# Altium schematic sheet 0053_DISPLAY - DDIA POR.SchDoc
size 848 x 558 mm
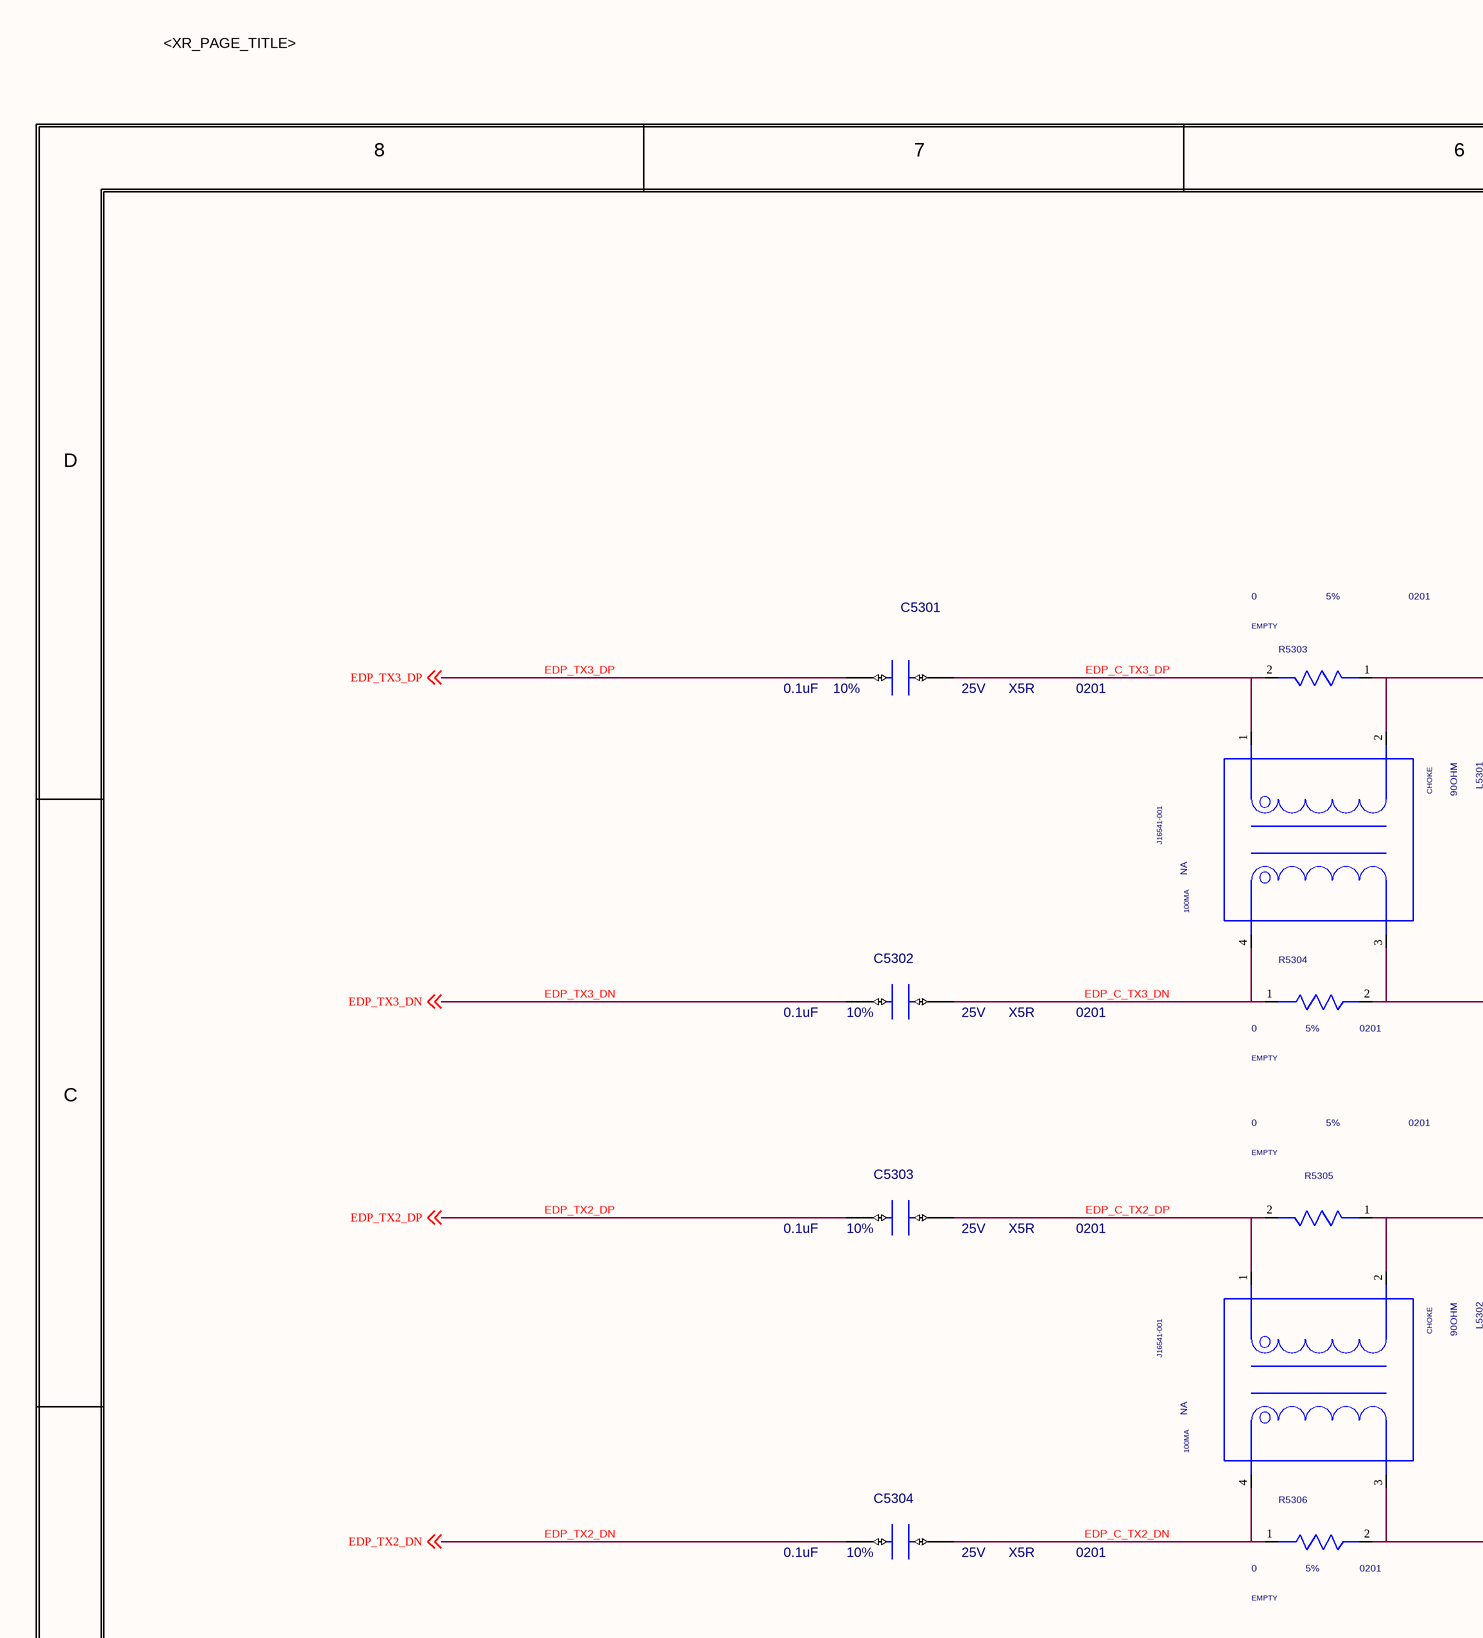
[diagram p0: 0053_DISPLAY - DDIA POR.SchDoc, top left]
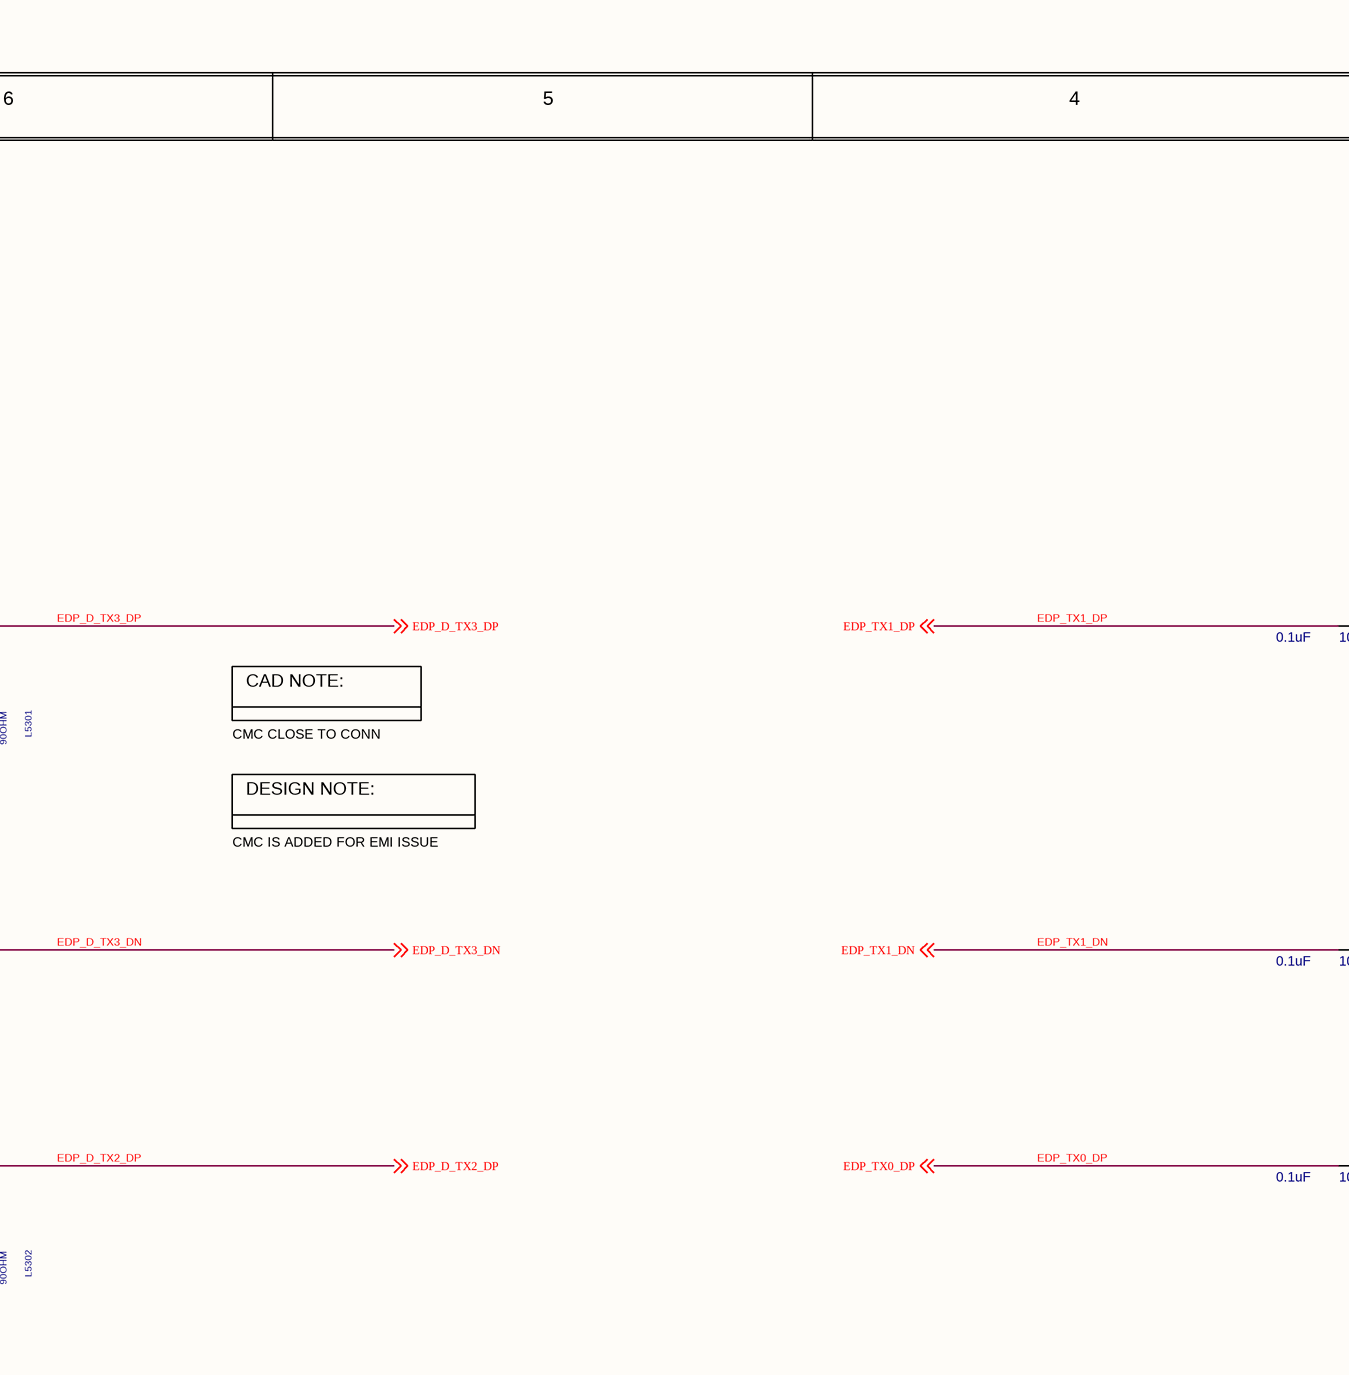
[diagram p1: 0053_DISPLAY - DDIA POR.SchDoc, top middle]
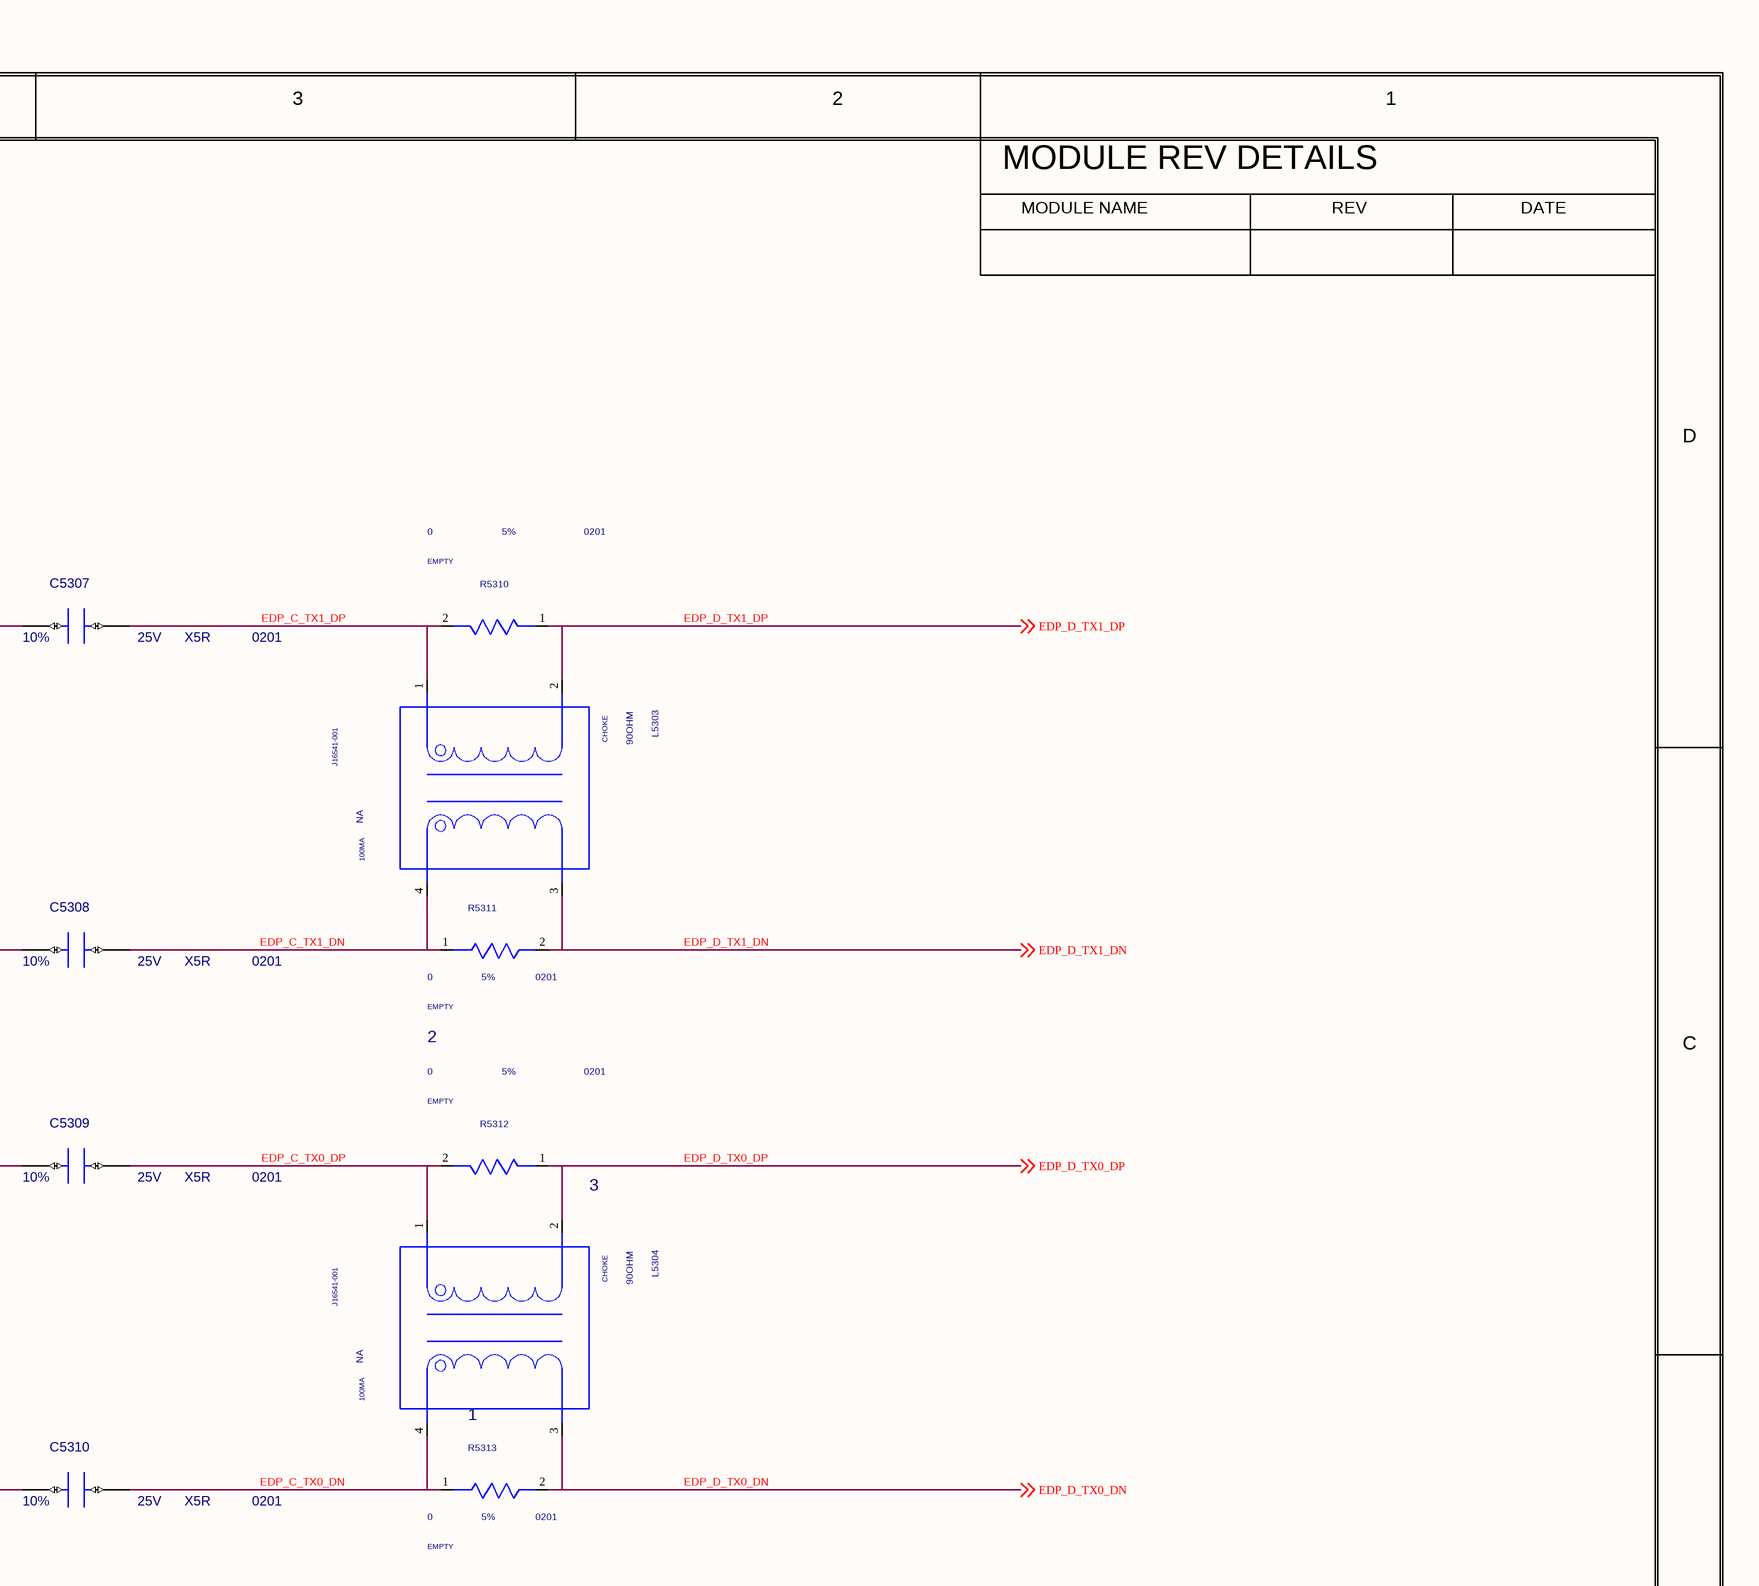
[diagram p2: 0053_DISPLAY - DDIA POR.SchDoc, top right]
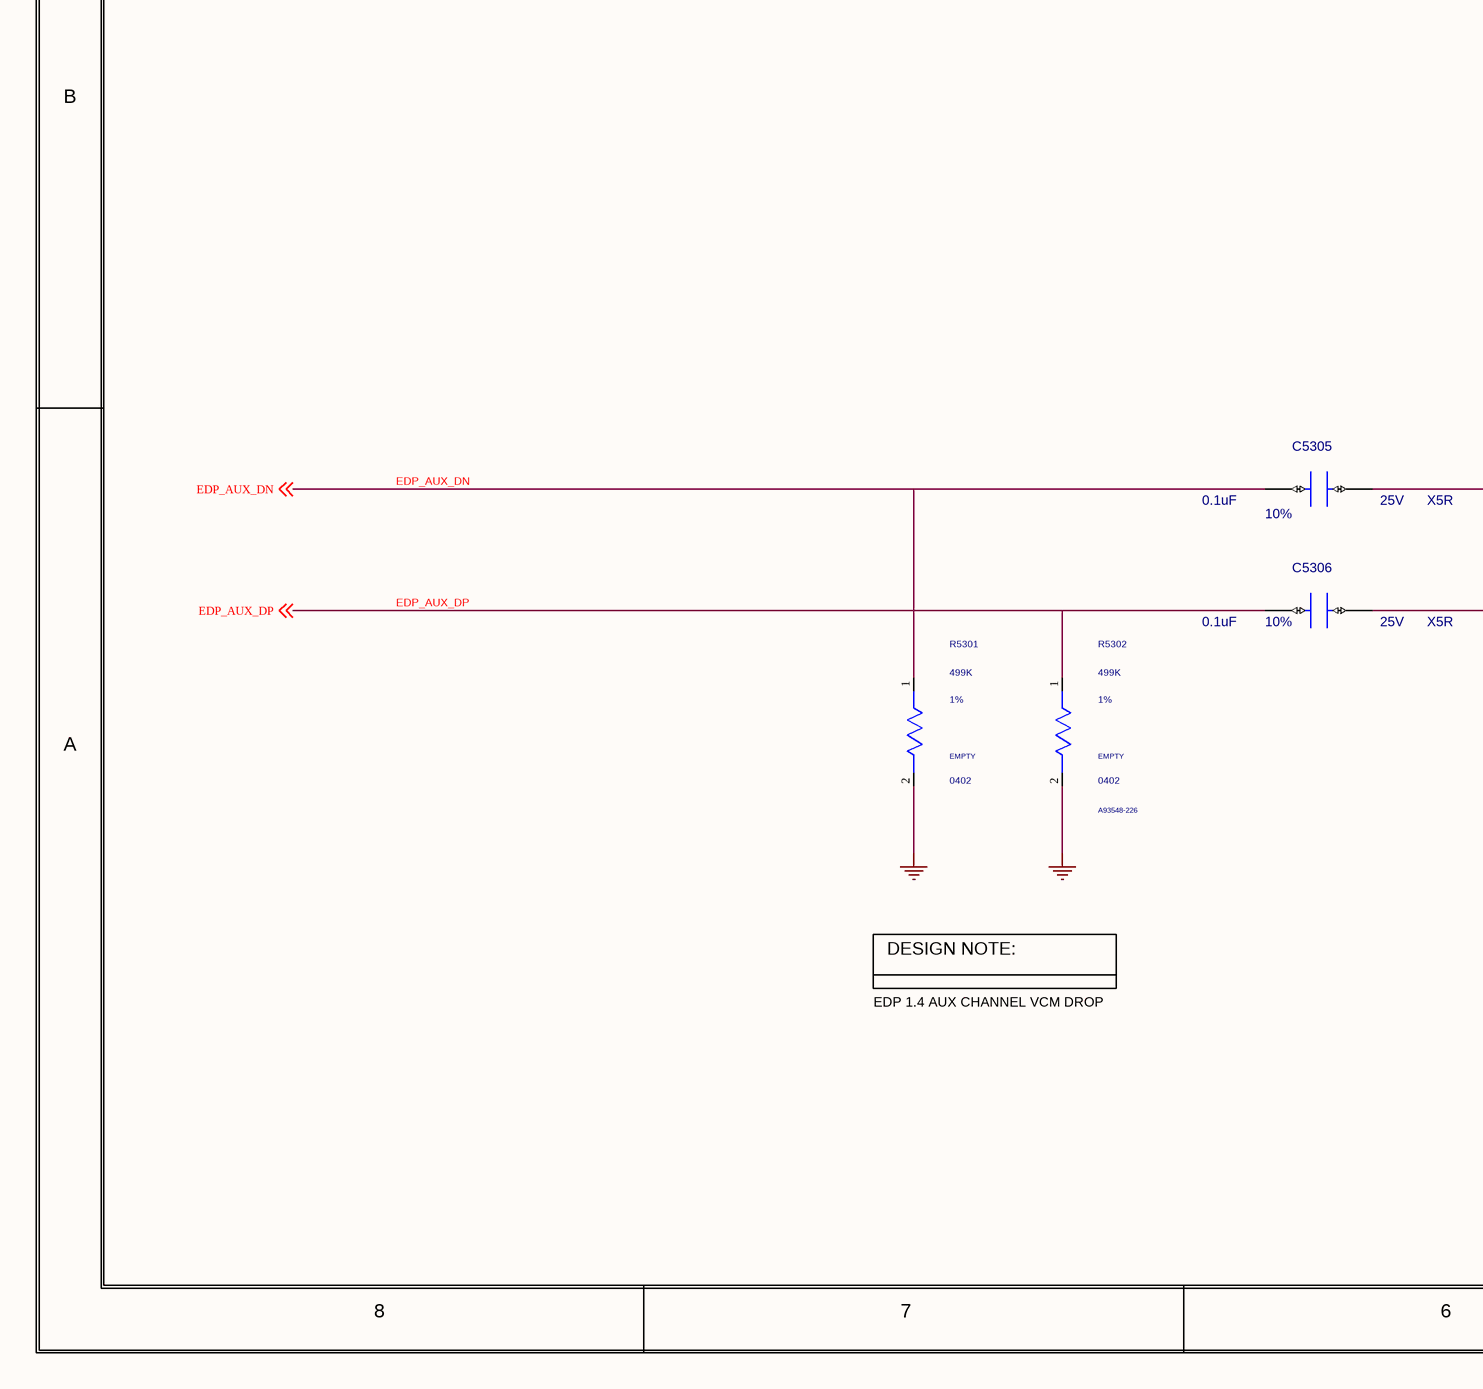
[diagram p3: 0053_DISPLAY - DDIA POR.SchDoc, bottom left]
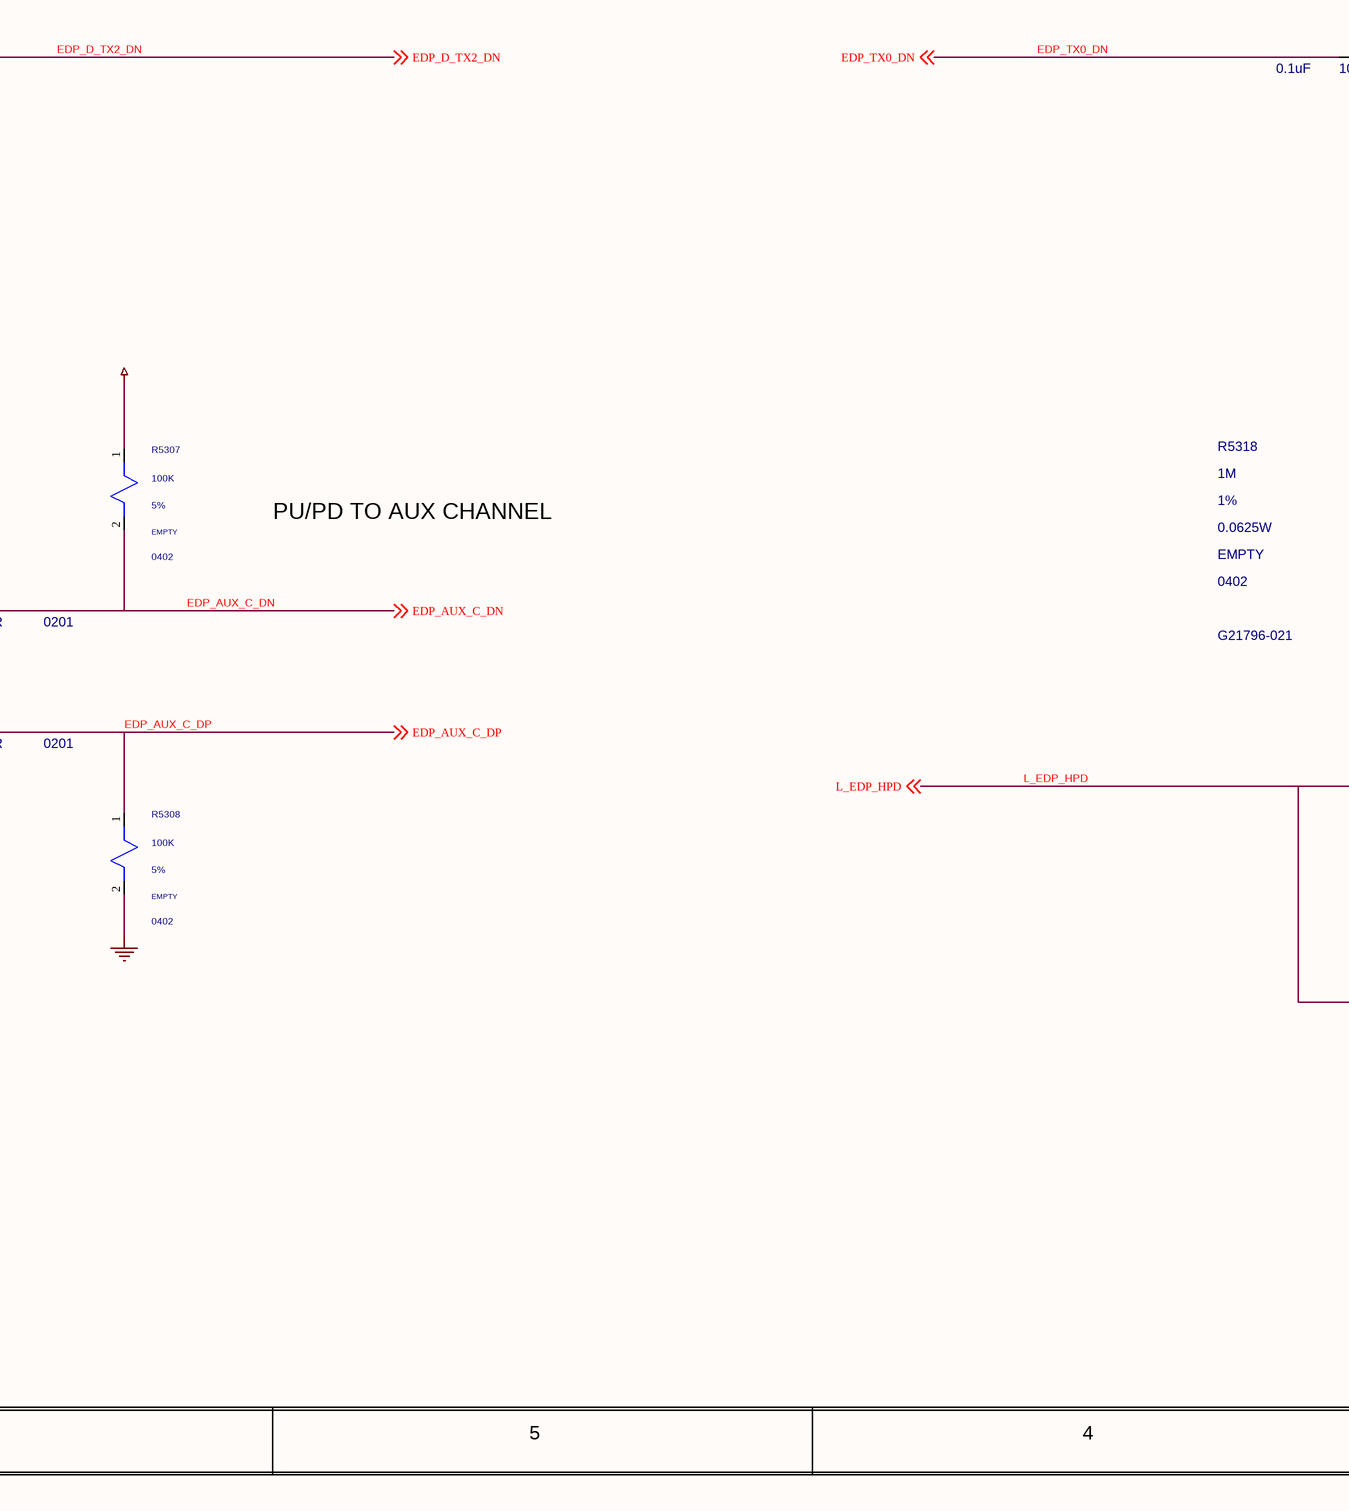
[diagram p4: 0053_DISPLAY - DDIA POR.SchDoc, bottom middle]
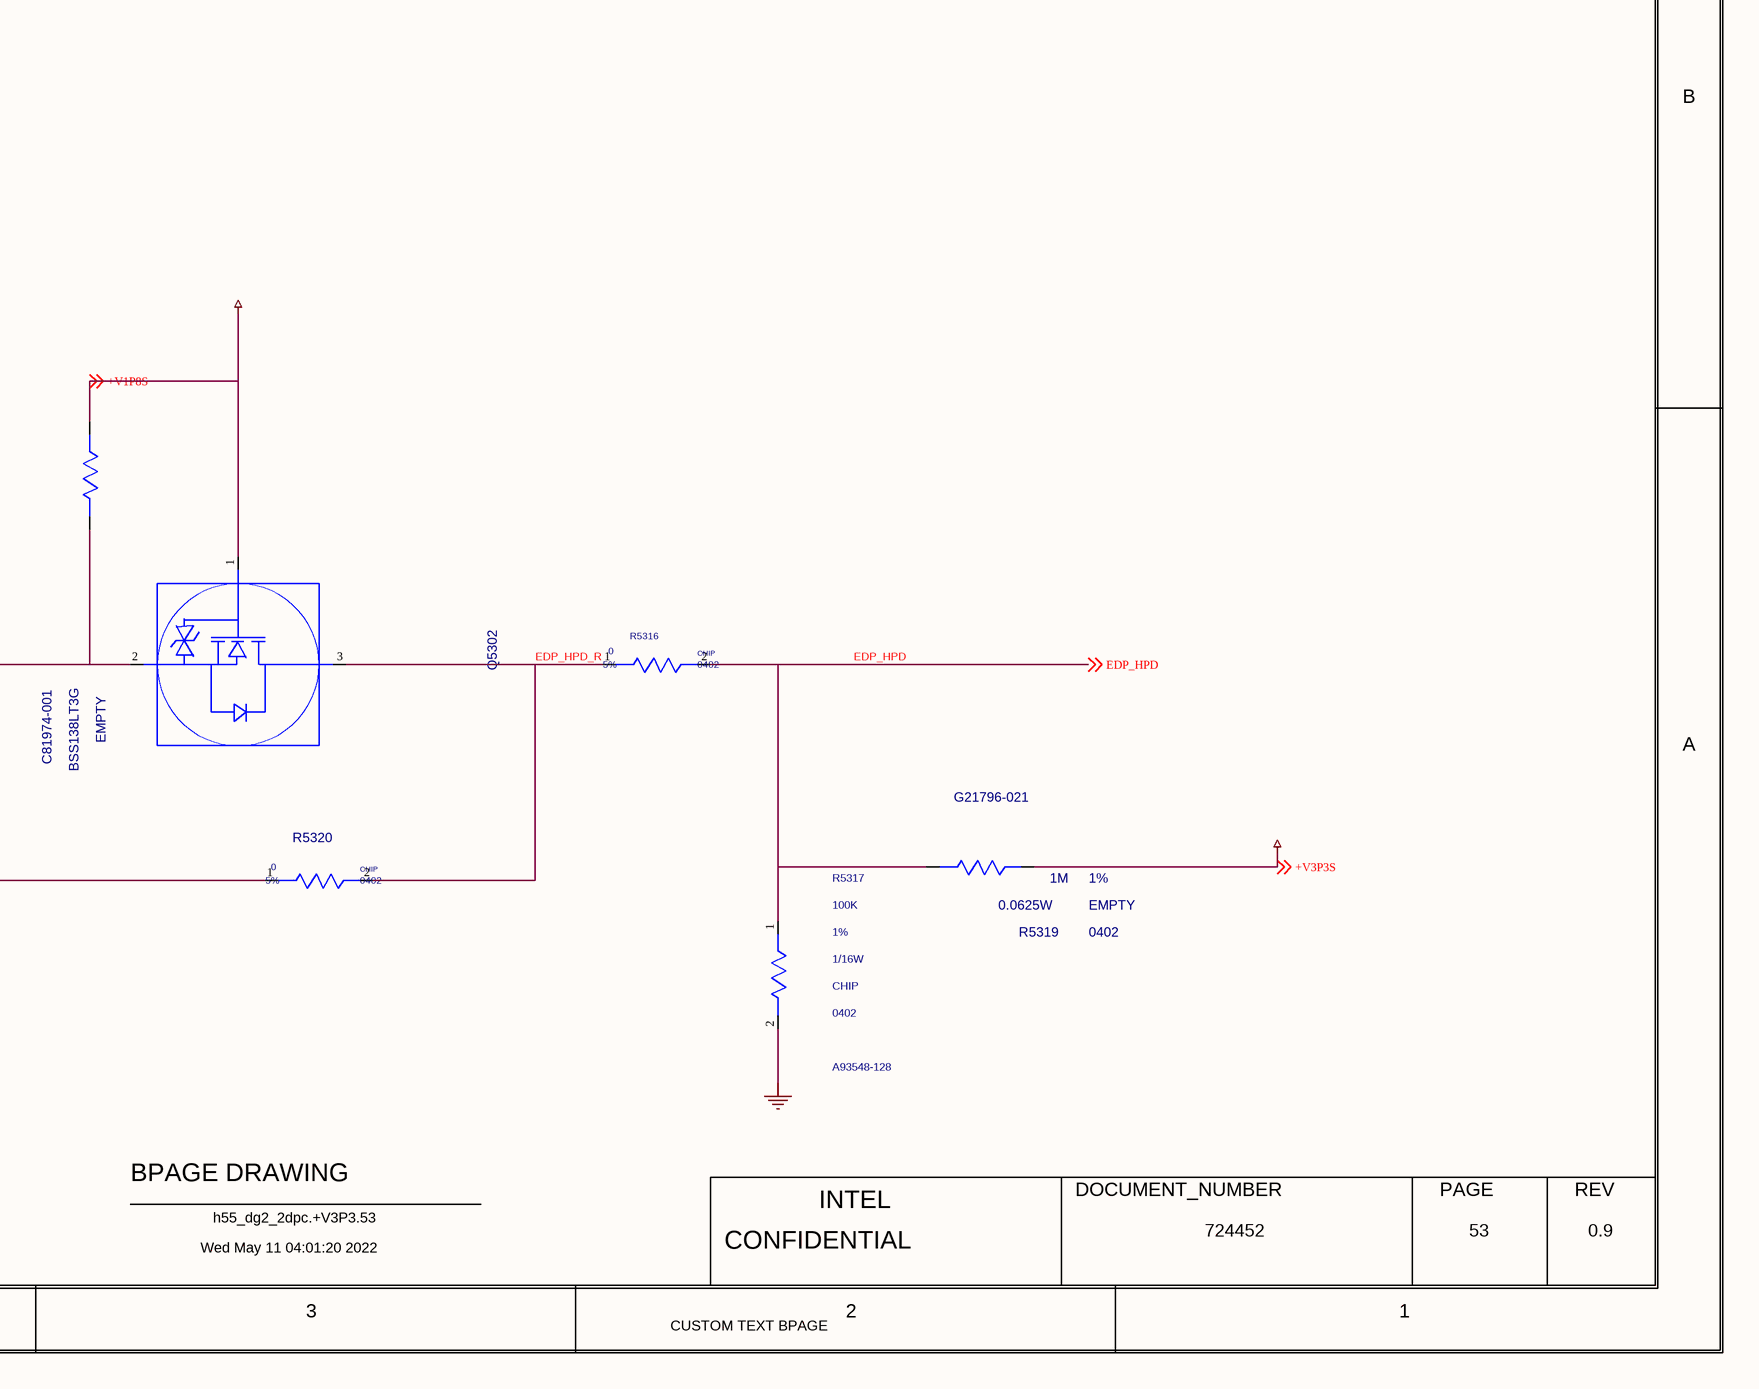
[diagram p5: 0053_DISPLAY - DDIA POR.SchDoc, bottom right]

## Parts
C5301  0.1uF  MATERIAL: X5R  PACK_TYPE: 0201  TOLERANCE: 10%  VOLTAGE: 25V  [CTK0_SM0201_650X350_MA]
C5302  0.1uF  MATERIAL: X5R  PACK_TYPE: 0201  TOLERANCE: 10%  VOLTAGE: 25V  [CTK0_SM0201_650X350_MA]
C5303  0.1uF  MATERIAL: X5R  PACK_TYPE: 0201  TOLERANCE: 10%  VOLTAGE: 25V  [CTK0_SM0201_650X350_MA]
C5304  0.1uF  MATERIAL: X5R  PACK_TYPE: 0201  TOLERANCE: 10%  VOLTAGE: 25V  [CTK0_SM0201_650X350_MA]
C5305  0.1uF  MATERIAL: X5R  PACK_TYPE: 0201  TOLERANCE: 10%  VOLTAGE: 25V  [CTK0_SM0201_650X350_MA]
C5306  0.1uF  MATERIAL: X5R  PACK_TYPE: 0201  TOLERANCE: 10%  VOLTAGE: 25V  [CTK0_SM0201_650X350_MA]
C5307  0.1uF  MATERIAL: X5R  PACK_TYPE: 0201  TOLERANCE: 10%  VOLTAGE: 25V  [CTK0_SM0201_650X350_MA]
C5308  0.1uF  MATERIAL: X5R  PACK_TYPE: 0201  TOLERANCE: 10%  VOLTAGE: 25V  [CTK0_SM0201_650X350_MA]
C5309  0.1uF  MATERIAL: X5R  PACK_TYPE: 0201  TOLERANCE: 10%  VOLTAGE: 25V  [CTK0_SM0201_650X350_MA]
C5310  0.1uF  MATERIAL: X5R  PACK_TYPE: 0201  TOLERANCE: 10%  VOLTAGE: 25V  [CTK0_SM0201_650X350_MA]
L5301  90OHM  CURRENT: 100MA  MATERIAL: CHOKE  PART_NUMBER: J16541-001  TOLERANCE: NA  [SMI4_50X65MA]
L5302  90OHM  CURRENT: 100MA  MATERIAL: CHOKE  PART_NUMBER: J16541-001  TOLERANCE: NA  [SMI4_50X65MA]
L5303  90OHM  CURRENT: 100MA  MATERIAL: CHOKE  PART_NUMBER: J16541-001  TOLERANCE: NA  [SMI4_50X65MA]
L5304  90OHM  CURRENT: 100MA  MATERIAL: CHOKE  PART_NUMBER: J16541-001  TOLERANCE: NA  REUSE_ID: 3  [SMI4_50X65MA]
Q5302  BSS138LT3G  MATERIAL: EMPTY  PART_NUMBER: C81974-001  [CTK2_SOT23_1400X3040_950_MA]
R5301  499K  MATERIAL: EMPTY  PACK_TYPE: 0402  TOLERANCE: 1%  [SMR0402IA]
R5302  499K  MATERIAL: EMPTY  PACK_TYPE: 0402  PART_NUMBER: A93548-226  TOLERANCE: 1%  [SMR0402IA]
R5303  0  MATERIAL: EMPTY  PACK_TYPE: 0201  TOLERANCE: 5%  [SMR0201IA]
R5304  0  MATERIAL: EMPTY  PACK_TYPE: 0201  TOLERANCE: 5%  [SMR0201IA]
R5305  0  MATERIAL: EMPTY  PACK_TYPE: 0201  TOLERANCE: 5%  [SMR0201IA]
R5306  0  MATERIAL: EMPTY  PACK_TYPE: 0201  TOLERANCE: 5%  [SMR0201IA]
R5307  100K  MATERIAL: EMPTY  PACK_TYPE: 0402  TOLERANCE: 5%  [SMR0402IA]
R5308  100K  MATERIAL: EMPTY  PACK_TYPE: 0402  TOLERANCE: 5%  [SMR0402IA]
R5310  0  MATERIAL: EMPTY  PACK_TYPE: 0201  TOLERANCE: 5%  [SMR0201IA]
R5311  0  MATERIAL: EMPTY  PACK_TYPE: 0201  TOLERANCE: 5%  [SMR0201IA]
R5312  0  MATERIAL: EMPTY  PACK_TYPE: 0201  TOLERANCE: 5%  REUSE_ID: 2  [SMR0201IA]
R5313  0  MATERIAL: EMPTY  PACK_TYPE: 0201  TOLERANCE: 5%  REUSE_ID: 1  [SMR0201IA]
R5316  0  MATERIAL: CHIP  PACK_TYPE: 0402  TOLERANCE: 5%  [SMR0402IA]
R5317  100K  MATERIAL: CHIP  PACK_TYPE: 0402  PART_NUMBER: A93548-128  TOLERANCE: 1%  WATTAGE: 1/16W  [SMR0402IA]
R5318  1M  MATERIAL: EMPTY  PACK_TYPE: 0402  PART_NUMBER: G21796-021  TOLERANCE: 1%  WATTAGE: 0.0625W  [CTK2_SM0402_1100X550_MA]
R5319  1M  MATERIAL: EMPTY  PACK_TYPE: 0402  PART_NUMBER: G21796-021  TOLERANCE: 1%  WATTAGE: 0.0625W  [CTK2_SM0402_1100X550_MA]
R5320  0  MATERIAL: CHIP  PACK_TYPE: 0402  TOLERANCE: 5%  [SMR0402IA]

## Nets
+V1P8S: Q5302.1(G) R5318.1(A) ; off-sheet +V1P8S
+V3P3S: R5307.1(A) R5319.2(B) ; off-sheet +V3P3S
GND: R5301.2(B) R5302.2(B) R5308.2(B) R5317.2(B)
EDP_AUX_C_DN: C5305.2(B) R5307.2(B) ; off-sheet EDP_AUX_C_DN
EDP_AUX_C_DP: C5306.2(B) R5308.1(A) ; off-sheet EDP_AUX_C_DP
EDP_AUX_DN: C5305.1(A) R5301.1(A) ; off-sheet EDP_AUX_DN
EDP_AUX_DP: C5306.1(A) R5302.1(A) ; off-sheet EDP_AUX_DP
EDP_C_TX0_DN: C5310.2(B) L5304.4(PIN4) R5313.1(A)
EDP_C_TX0_DP: C5309.2(B) L5304.1(PIN1) R5312.2(B)
EDP_C_TX1_DN: C5308.2(B) L5303.4(PIN4) R5311.1(A)
EDP_C_TX1_DP: C5307.2(B) L5303.1(PIN1) R5310.2(B)
EDP_C_TX2_DN: C5304.2(B) L5302.4(PIN4) R5306.1(A)
EDP_C_TX2_DP: C5303.2(B) L5302.1(PIN1) R5305.2(B)
EDP_C_TX3_DN: C5302.2(B) L5301.4(PIN4) R5304.1(A)
EDP_C_TX3_DP: C5301.2(B) L5301.1(PIN1) R5303.2(B)
EDP_D_TX0_DN: L5304.3(PIN3) R5313.2(B) ; off-sheet EDP_D_TX0_DN
EDP_D_TX0_DP: L5304.2(PIN2) R5312.1(A) ; off-sheet EDP_D_TX0_DP
EDP_D_TX1_DN: L5303.3(PIN3) R5311.2(B) ; off-sheet EDP_D_TX1_DN
EDP_D_TX1_DP: L5303.2(PIN2) R5310.1(A) ; off-sheet EDP_D_TX1_DP
EDP_D_TX2_DN: L5302.3(PIN3) R5306.2(B) ; off-sheet EDP_D_TX2_DN
EDP_D_TX2_DP: L5302.2(PIN2) R5305.1(A) ; off-sheet EDP_D_TX2_DP
EDP_D_TX3_DN: L5301.3(PIN3) R5304.2(B) ; off-sheet EDP_D_TX3_DN
EDP_D_TX3_DP: L5301.2(PIN2) R5303.1(A) ; off-sheet EDP_D_TX3_DP
EDP_HPD: R5316.2(B) R5317.1(A) R5319.1(A) ; off-sheet EDP_HPD
EDP_HPD_R: Q5302.3(D) R5316.1(A) R5320.2(B)
EDP_TX0_DN: C5310.1(A) ; off-sheet EDP_TX0_DN
EDP_TX0_DP: C5309.1(A) ; off-sheet EDP_TX0_DP
EDP_TX1_DN: C5308.1(A) ; off-sheet EDP_TX1_DN
EDP_TX1_DP: C5307.1(A) ; off-sheet EDP_TX1_DP
EDP_TX2_DN: C5304.1(A) ; off-sheet EDP_TX2_DN
EDP_TX2_DP: C5303.1(A) ; off-sheet EDP_TX2_DP
EDP_TX3_DN: C5302.1(A) ; off-sheet EDP_TX3_DN
EDP_TX3_DP: C5301.1(A) ; off-sheet EDP_TX3_DP
L_EDP_HPD: Q5302.2(S) R5318.2(B) R5320.1(A) ; off-sheet L_EDP_HPD

## Notes on the sheet
- <XR_PAGE_TITLE>
- 8
- 7
- 6
- 5
- 4
- 3
- 2
- 1
- MODULE REV DETAILS
- MODULE NAME
- REV
- DATE
- D
- CMC CLOSE TO CONN
- CAD NOTE:
- DESIGN NOTE:
- CMC IS ADDED FOR EMI ISSUE
- C
- B
- PU/PD TO AUX CHANNEL
- A
- EDP 1.4 AUX CHANNEL VCM DROP
- BPAGE DRAWING
- INTEL
- DOCUMENT_NUMBER
- PAGE
- Wed May 11 04:01:20 2022
- h55_dg2_2dpc.+V3P3.53
- CONFIDENTIAL
- 724452
- 53
- 0.9
- CUSTOM TEXT BPAGE

## Library data of the parts
C5301 = C_CAP#1: PART_NUMBER: C83410-027; CHIPS_PART_NAME: C_CAP; CDS_PHYS_PART_NAME: C_CAP_0201-C83410-027,X5R,0.1UF,25V,10%,TK0,GENERIC; CDS_LMAN_SYM_OUTLINE: -50,50,50,-50; FP_TECH: TK0; IP: GENERIC; ROOM: NONE; OriginalSymbolOrigin: (-25,50); XY: (600,3175); VER: 2; ROT: 0; PHYS_PAGE: 53; LOCATION: C5301; DRAWING: @RVP1_ADL_SB_ADP_S_DDR5_SODIMM_2DPC_LIB.H55_DG2_2DPC(SCH_1):PAGE53; CDS_LIB: c_discrete; VARIANT: ?; PCB Footprint: CTK0_SM0201_650X350_MA; CDS_PART_NAME: C_CAP_0201-C83410-027,X5R,0.1UF,25V,10%,TK0,GENERIC; CDS_LOCATION: C5301
C5302 = C_CAP#1: PART_NUMBER: C83410-027; CHIPS_PART_NAME: C_CAP; CDS_PHYS_PART_NAME: C_CAP_0201-C83410-027,X5R,0.1UF,25V,10%,TK0,GENERIC; CDS_LMAN_SYM_OUTLINE: -50,50,50,-50; FP_TECH: TK0; IP: GENERIC; ROOM: NONE; OriginalSymbolOrigin: (-25,50); XY: (600,2575); VER: 2; ROT: 0; PHYS_PAGE: 53; LOCATION: C5302; DRAWING: @RVP1_ADL_SB_ADP_S_DDR5_SODIMM_2DPC_LIB.H55_DG2_2DPC(SCH_1):PAGE53; CDS_LIB: c_discrete; VARIANT: ?; PCB Footprint: CTK0_SM0201_650X350_MA; CDS_PART_NAME: C_CAP_0201-C83410-027,X5R,0.1UF,25V,10%,TK0,GENERIC; CDS_LOCATION: C5302
C5303 = C_CAP#1: PART_NUMBER: C83410-027; CHIPS_PART_NAME: C_CAP; CDS_PHYS_PART_NAME: C_CAP_0201-C83410-027,X5R,0.1UF,25V,10%,TK0,GENERIC; CDS_LMAN_SYM_OUTLINE: -50,50,50,-50; FP_TECH: TK0; IP: GENERIC; ROOM: NONE; OriginalSymbolOrigin: (-25,50); XY: (600,2175); VER: 2; ROT: 0; PHYS_PAGE: 53; LOCATION: C5303; DRAWING: @RVP1_ADL_SB_ADP_S_DDR5_SODIMM_2DPC_LIB.H55_DG2_2DPC(SCH_1):PAGE53; CDS_LIB: c_discrete; VARIANT: ?; PCB Footprint: CTK0_SM0201_650X350_MA; CDS_PART_NAME: C_CAP_0201-C83410-027,X5R,0.1UF,25V,10%,TK0,GENERIC; CDS_LOCATION: C5303
C5304 = C_CAP#1: PART_NUMBER: C83410-027; CHIPS_PART_NAME: C_CAP; CDS_PHYS_PART_NAME: C_CAP_0201-C83410-027,X5R,0.1UF,25V,10%,TK0,GENERIC; CDS_LMAN_SYM_OUTLINE: -50,50,50,-50; FP_TECH: TK0; IP: GENERIC; ROOM: NONE; OriginalSymbolOrigin: (-25,50); XY: (600,1575); VER: 2; ROT: 0; PHYS_PAGE: 53; LOCATION: C5304; DRAWING: @RVP1_ADL_SB_ADP_S_DDR5_SODIMM_2DPC_LIB.H55_DG2_2DPC(SCH_1):PAGE53; CDS_LIB: c_discrete; VARIANT: ?; PCB Footprint: CTK0_SM0201_650X350_MA; CDS_PART_NAME: C_CAP_0201-C83410-027,X5R,0.1UF,25V,10%,TK0,GENERIC; CDS_LOCATION: C5304
C5305 = C_CAP#1: PART_NUMBER: C83410-027; CHIPS_PART_NAME: C_CAP; CDS_PHYS_PART_NAME: C_CAP_0201-C83410-027,X5R,0.1UF,25V,10%,TK0,GENERIC; CDS_LMAN_SYM_OUTLINE: -50,50,50,-50; FP_TECH: TK0; IP: GENERIC; ROOM: NONE; OriginalSymbolOrigin: (-25,50); XY: (1375,550); VER: 2; ROT: 0; PHYS_PAGE: 53; LOCATION: C5305; DRAWING: @RVP1_ADL_SB_ADP_S_DDR5_SODIMM_2DPC_LIB.H55_DG2_2DPC(SCH_1):PAGE53; CDS_LIB: c_discrete; VARIANT: ?; PCB Footprint: CTK0_SM0201_650X350_MA; CDS_PART_NAME: C_CAP_0201-C83410-027,X5R,0.1UF,25V,10%,TK0,GENERIC; CDS_LOCATION: C5305
C5306 = C_CAP#1: PART_NUMBER: C83410-027; CHIPS_PART_NAME: C_CAP; CDS_PHYS_PART_NAME: C_CAP_0201-C83410-027,X5R,0.1UF,25V,10%,TK0,GENERIC; CDS_LMAN_SYM_OUTLINE: -50,50,50,-50; FP_TECH: TK0; IP: GENERIC; ROOM: NONE; OriginalSymbolOrigin: (-25,50); XY: (1375,325); VER: 2; ROT: 0; PHYS_PAGE: 53; LOCATION: C5306; DRAWING: @RVP1_ADL_SB_ADP_S_DDR5_SODIMM_2DPC_LIB.H55_DG2_2DPC(SCH_1):PAGE53; CDS_LIB: c_discrete; VARIANT: ?; PCB Footprint: CTK0_SM0201_650X350_MA; CDS_PART_NAME: C_CAP_0201-C83410-027,X5R,0.1UF,25V,10%,TK0,GENERIC; CDS_LOCATION: C5306
C5307 = C_CAP#1: PART_NUMBER: C83410-027; CHIPS_PART_NAME: C_CAP; CDS_PHYS_PART_NAME: C_CAP_0201-C83410-027,X5R,0.1UF,25V,10%,TK0,GENERIC; CDS_LMAN_SYM_OUTLINE: -50,50,50,-50; FP_TECH: TK0; IP: GENERIC; ROOM: NONE; OriginalSymbolOrigin: (-25,50); XY: (4200,3175); VER: 2; ROT: 0; PHYS_PAGE: 53; LOCATION: C5307; DRAWING: @RVP1_ADL_SB_ADP_S_DDR5_SODIMM_2DPC_LIB.H55_DG2_2DPC(SCH_1):PAGE53; CDS_LIB: c_discrete; VARIANT: ?; PCB Footprint: CTK0_SM0201_650X350_MA; CDS_PART_NAME: C_CAP_0201-C83410-027,X5R,0.1UF,25V,10%,TK0,GENERIC; CDS_LOCATION: C5307
C5308 = C_CAP#1: PART_NUMBER: C83410-027; CHIPS_PART_NAME: C_CAP; CDS_PHYS_PART_NAME: C_CAP_0201-C83410-027,X5R,0.1UF,25V,10%,TK0,GENERIC; CDS_LMAN_SYM_OUTLINE: -50,50,50,-50; FP_TECH: TK0; IP: GENERIC; ROOM: NONE; OriginalSymbolOrigin: (-25,50); XY: (4200,2575); VER: 2; ROT: 0; PHYS_PAGE: 53; LOCATION: C5308; DRAWING: @RVP1_ADL_SB_ADP_S_DDR5_SODIMM_2DPC_LIB.H55_DG2_2DPC(SCH_1):PAGE53; CDS_LIB: c_discrete; VARIANT: ?; PCB Footprint: CTK0_SM0201_650X350_MA; CDS_PART_NAME: C_CAP_0201-C83410-027,X5R,0.1UF,25V,10%,TK0,GENERIC; CDS_LOCATION: C5308
C5309 = C_CAP#1: PART_NUMBER: C83410-027; CHIPS_PART_NAME: C_CAP; CDS_PHYS_PART_NAME: C_CAP_0201-C83410-027,X5R,0.1UF,25V,10%,TK0,GENERIC; CDS_LMAN_SYM_OUTLINE: -50,50,50,-50; FP_TECH: TK0; IP: GENERIC; ROOM: NONE; OriginalSymbolOrigin: (-25,50); XY: (4200,2175); VER: 2; ROT: 0; PHYS_PAGE: 53; LOCATION: C5309; DRAWING: @RVP1_ADL_SB_ADP_S_DDR5_SODIMM_2DPC_LIB.H55_DG2_2DPC(SCH_1):PAGE53; CDS_LIB: c_discrete; VARIANT: ?; PCB Footprint: CTK0_SM0201_650X350_MA; CDS_PART_NAME: C_CAP_0201-C83410-027,X5R,0.1UF,25V,10%,TK0,GENERIC; CDS_LOCATION: C5309
C5310 = C_CAP#1: PART_NUMBER: C83410-027; CHIPS_PART_NAME: C_CAP; CDS_PHYS_PART_NAME: C_CAP_0201-C83410-027,X5R,0.1UF,25V,10%,TK0,GENERIC; CDS_LMAN_SYM_OUTLINE: -50,50,50,-50; FP_TECH: TK0; IP: GENERIC; ROOM: NONE; OriginalSymbolOrigin: (-25,50); XY: (4200,1575); VER: 2; ROT: 0; PHYS_PAGE: 53; LOCATION: C5310; DRAWING: @RVP1_ADL_SB_ADP_S_DDR5_SODIMM_2DPC_LIB.H55_DG2_2DPC(SCH_1):PAGE53; CDS_LIB: c_discrete; VARIANT: ?; PCB Footprint: CTK0_SM0201_650X350_MA; CDS_PART_NAME: C_CAP_0201-C83410-027,X5R,0.1UF,25V,10%,TK0,GENERIC; CDS_LOCATION: C5310
L5301 = CHOKE_4P: CDS_PHYS_PART_NAME: CHOKE_4P_SM3-J16541-001,CHOKE,90OHM,NA,100MA,LPDB,GENERIC; CDS_LMAN_SYM_OUTLINE: -150,200,150,-150; PACK_TYPE: SM3; OriginalSymbolOrigin: (-175,200); XY: (1350,2875); VER: 10; ROT: 5; PHYS_PAGE: 53; LOCATION: L5301; IP: GENERIC; FP_TECH: LPDB; DRAWING: @RVP1_ADL_SB_ADP_S_DDR5_SODIMM_2DPC_LIB.H55_DG2_2DPC(SCH_1):PAGE53; CDS_LIB: discrete; PCB Footprint: SMI4_50X65MA; SEC_TYPE: SM3; CHIPS_PART_NAME: CHOKE_4P; CDS_PART_NAME: CHOKE_4P_SM3-J16541-001,CHOKE,90OHM,NA,100MA,LPDB,GENERIC; CDS_LOCATION: L5301; ASI_MODEL: J16541-001
L5302 = CHOKE_4P: CDS_PHYS_PART_NAME: CHOKE_4P_SM3-J16541-001,CHOKE,90OHM,NA,100MA,LPDB,GENERIC; CDS_LMAN_SYM_OUTLINE: -150,200,150,-150; PACK_TYPE: SM3; OriginalSymbolOrigin: (-175,200); XY: (1350,1875); VER: 10; ROT: 5; PHYS_PAGE: 53; LOCATION: L5302; IP: GENERIC; FP_TECH: LPDB; DRAWING: @RVP1_ADL_SB_ADP_S_DDR5_SODIMM_2DPC_LIB.H55_DG2_2DPC(SCH_1):PAGE53; CDS_LIB: discrete; PCB Footprint: SMI4_50X65MA; CHIPS_PART_NAME: CHOKE_4P; CDS_PART_NAME: CHOKE_4P_SM3-J16541-001,CHOKE,90OHM,NA,100MA,LPDB,GENERIC; CDS_LOCATION: L5302; ASI_MODEL: J16541-001
L5303 = CHOKE_4P: CDS_PHYS_PART_NAME: CHOKE_4P_SM3-J16541-001,CHOKE,90OHM,NA,100MA,LPDB,GENERIC; CDS_LMAN_SYM_OUTLINE: -150,200,150,-150; PACK_TYPE: SM3; OriginalSymbolOrigin: (-175,200); XY: (4950,2875); VER: 10; ROT: 5; PHYS_PAGE: 53; LOCATION: L5303; IP: GENERIC; FP_TECH: LPDB; DRAWING: @RVP1_ADL_SB_ADP_S_DDR5_SODIMM_2DPC_LIB.H55_DG2_2DPC(SCH_1):PAGE53; CDS_LIB: discrete; PCB Footprint: SMI4_50X65MA; CHIPS_PART_NAME: CHOKE_4P; CDS_PART_NAME: CHOKE_4P_SM3-J16541-001,CHOKE,90OHM,NA,100MA,LPDB,GENERIC; CDS_LOCATION: L5303; ASI_MODEL: J16541-001
L5304 = CHOKE_4P: CDS_PHYS_PART_NAME: CHOKE_4P_SM3-J16541-001,CHOKE,90OHM,NA,100MA,LPDB,GENERIC; CDS_LMAN_SYM_OUTLINE: -150,200,150,-150; PACK_TYPE: SM3; OriginalSymbolOrigin: (-175,200); XY: (4950,1875); VER: 10; ROT: 5; PHYS_PAGE: 53; LOCATION: L5304; IP: GENERIC; FP_TECH: LPDB; DRAWING: @RVP1_ADL_SB_ADP_S_DDR5_SODIMM_2DPC_LIB.H55_DG2_2DPC(SCH_1):PAGE53; CDS_LIB: discrete; PCB Footprint: SMI4_50X65MA; CHIPS_PART_NAME: CHOKE_4P; CDS_PART_NAME: CHOKE_4P_SM3-J16541-001,CHOKE,90OHM,NA,100MA,LPDB,GENERIC; CDS_LOCATION: L5304; ASI_MODEL: J16541-001
Q5302 = C_MOSFET_N: CDS_PHYS_PART_NAME: C_MOSFET_N_SOT23-C81974-001,EMPTY,BSS138LT3G,TK2,GENERIC; CDS_LMAN_SYM_OUTLINE: -150,150,150,-150; FP_TECH: TK2; IP: GENERIC; PACK_TYPE: SOT23; ROOM: NONE; OriginalSymbolOrigin: (-175,175); XY: (4500,225); VER: 2; ROT: 5; PHYS_PAGE: 53; LOCATION: Q5302; DRAWING: @RVP1_ADL_SB_ADP_S_DDR5_SODIMM_2DPC_LIB.H55_DG2_2DPC(SCH_1):PAGE53; CDS_LIB: local; VARIANT: ?; PCB Footprint: CTK2_SOT23_1400X3040_950_MA; CHIPS_PART_NAME: C_MOSFET_N; CDS_PART_NAME: C_MOSFET_N_SOT23-C81974-001,EMPTY,BSS138LT3G,TK2,GENERIC; CDS_LOCATION: Q5302
R5301 = RES: PART_NUMBER: A93548-226; CDS_PHYS_PART_NAME: RES_0402-A93548-226,EMPTY,499K,1%,1/16W,LPDB,GENERIC; WATTAGE: 1/16W; OriginalSymbolOrigin: (-25,75); XY: (625,100); VER: 2; ROT: 0; PHYS_PAGE: 53; LOCATION: R5301; IP: GENERIC; FP_TECH: LPDB; DRAWING: @RVP1_ADL_SB_ADP_S_DDR5_SODIMM_2DPC_LIB.H55_DG2_2DPC(SCH_1):PAGE53; CDS_LIB: discrete; PCB Footprint: SMR0402IA; SEC_TYPE: 0402; CHIPS_PART_NAME: RES; CDS_PART_NAME: RES_0402-A93548-226,EMPTY,499K,1%,1/16W,LPDB,GENERIC; CDS_LOCATION: R5301; ASI_MODEL: A93548-226
R5302 = RES: CDS_PHYS_PART_NAME: RES_0402-A93548-226,EMPTY,499K,1%,1/16W,LPDB,GENERIC; WATTAGE: 1/16W; OriginalSymbolOrigin: (-25,75); XY: (900,100); VER: 2; ROT: 0; PHYS_PAGE: 53; LOCATION: R5302; IP: GENERIC; FP_TECH: LPDB; DRAWING: @RVP1_ADL_SB_ADP_S_DDR5_SODIMM_2DPC_LIB.H55_DG2_2DPC(SCH_1):PAGE53; CDS_LIB: discrete; PCB Footprint: SMR0402IA; SEC_TYPE: 0402; CHIPS_PART_NAME: RES; CDS_PART_NAME: RES_0402-A93548-226,EMPTY,499K,1%,1/16W,LPDB,GENERIC; CDS_LOCATION: R5302; ASI_MODEL: A93548-226
R5303 = RES#1: PART_NUMBER: C80792-009; CHIPS_PART_NAME: RES; CDS_PHYS_PART_NAME: RES_0201-C80792-009,EMPTY,0,5%,1/20W,LPDB,GENERIC; WATTAGE: 1/20W; OriginalSymbolOrigin: (-75,25); XY: (1375,3175); VER: 1; ROT: 2; PHYS_PAGE: 53; LOCATION: R5303; IP: GENERIC; FP_TECH: LPDB; FIN: USB_BPR; DRAWING: @RVP1_ADL_SB_ADP_S_DDR5_SODIMM_2DPC_LIB.H55_DG2_2DPC(SCH_1):PAGE53; CDS_LIB: discrete; PCB Footprint: SMR0201IA; CDS_PART_NAME: RES_0201-C80792-009,EMPTY,0,5%,1/20W,LPDB,GENERIC; CDS_LOCATION: R5303; ASI_MODEL: C80792-009
R5304 = RES#1: PART_NUMBER: C80792-009; CHIPS_PART_NAME: RES; CDS_PHYS_PART_NAME: RES_0201-C80792-009,EMPTY,0,5%,1/20W,LPDB,GENERIC; WATTAGE: 1/20W; OriginalSymbolOrigin: (-75,25); XY: (1375,2575); VER: 1; PHYS_PAGE: 53; LOCATION: R5304; IP: GENERIC; FP_TECH: LPDB; FIN: USB_BPR; DRAWING: @RVP1_ADL_SB_ADP_S_DDR5_SODIMM_2DPC_LIB.H55_DG2_2DPC(SCH_1):PAGE53; CDS_LIB: discrete; PCB Footprint: SMR0201IA; ROT: 0; CDS_PART_NAME: RES_0201-C80792-009,EMPTY,0,5%,1/20W,LPDB,GENERIC; CDS_LOCATION: R5304; ASI_MODEL: C80792-009
R5305 = RES#1: PART_NUMBER: C80792-009; CHIPS_PART_NAME: RES; CDS_PHYS_PART_NAME: RES_0201-C80792-009,EMPTY,0,5%,1/20W,LPDB,GENERIC; WATTAGE: 1/20W; OriginalSymbolOrigin: (-75,25); XY: (1375,2175); VER: 1; ROT: 2; PHYS_PAGE: 53; LOCATION: R5305; IP: GENERIC; FP_TECH: LPDB; FIN: USB_BPR; DRAWING: @RVP1_ADL_SB_ADP_S_DDR5_SODIMM_2DPC_LIB.H55_DG2_2DPC(SCH_1):PAGE53; CDS_LIB: discrete; PCB Footprint: SMR0201IA; CDS_PART_NAME: RES_0201-C80792-009,EMPTY,0,5%,1/20W,LPDB,GENERIC; CDS_LOCATION: R5305; ASI_MODEL: C80792-009
R5306 = RES#1: PART_NUMBER: C80792-009; CHIPS_PART_NAME: RES; CDS_PHYS_PART_NAME: RES_0201-C80792-009,EMPTY,0,5%,1/20W,LPDB,GENERIC; WATTAGE: 1/20W; OriginalSymbolOrigin: (-75,25); XY: (1375,1575); VER: 1; PHYS_PAGE: 53; LOCATION: R5306; IP: GENERIC; FP_TECH: LPDB; FIN: USB_BPR; DRAWING: @RVP1_ADL_SB_ADP_S_DDR5_SODIMM_2DPC_LIB.H55_DG2_2DPC(SCH_1):PAGE53; CDS_LIB: discrete; PCB Footprint: SMR0201IA; ROT: 0; CDS_PART_NAME: RES_0201-C80792-009,EMPTY,0,5%,1/20W,LPDB,GENERIC; CDS_LOCATION: R5306; ASI_MODEL: C80792-009
R5307 = RES#3: PART_NUMBER: A93549-027; CHIPS_PART_NAME: RES; CDS_PHYS_PART_NAME: RES_0402-A93549-027,EMPTY,100K,5%,1/16W,LPDB,GENERIC; WATTAGE: 1/16W; OriginalSymbolOrigin: (-25,75); XY: (1850,750); VER: 4; ROT: 0; PHYS_PAGE: 53; LOCATION: R5307; IP: GENERIC; FP_TECH: LPDB; FIN: EDP; DRAWING: @RVP1_ADL_SB_ADP_S_DDR5_SODIMM_2DPC_LIB.H55_DG2_2DPC(SCH_1):PAGE53; CDS_LIB: discrete; BOM: HDMI; PCB Footprint: SMR0402IA; CDS_PART_NAME: RES_0402-A93549-027,EMPTY,100K,5%,1/16W,LPDB,GENERIC; CDS_LOCATION: R5307; ASI_MODEL: A93549-027
R5308 = RES#3: PART_NUMBER: A93549-027; CHIPS_PART_NAME: RES; CDS_PHYS_PART_NAME: RES_0402-A93549-027,EMPTY,100K,5%,1/16W,LPDB,GENERIC; WATTAGE: 1/16W; OriginalSymbolOrigin: (-25,75); XY: (1850,75); VER: 4; ROT: 0; PHYS_PAGE: 53; LOCATION: R5308; IP: GENERIC; FP_TECH: LPDB; FIN: EDP; DRAWING: @RVP1_ADL_SB_ADP_S_DDR5_SODIMM_2DPC_LIB.H55_DG2_2DPC(SCH_1):PAGE53; CDS_LIB: discrete; BOM: HDMI; PCB Footprint: SMR0402IA; CDS_PART_NAME: RES_0402-A93549-027,EMPTY,100K,5%,1/16W,LPDB,GENERIC; CDS_LOCATION: R5308; ASI_MODEL: A93549-027
R5310 = RES#1: PART_NUMBER: C80792-009; CHIPS_PART_NAME: RES; CDS_PHYS_PART_NAME: RES_0201-C80792-009,EMPTY,0,5%,1/20W,LPDB,GENERIC; WATTAGE: 1/20W; OriginalSymbolOrigin: (-75,25); XY: (4975,3175); VER: 1; ROT: 2; PHYS_PAGE: 53; LOCATION: R5310; IP: GENERIC; FP_TECH: LPDB; FIN: USB_BPR; DRAWING: @RVP1_ADL_SB_ADP_S_DDR5_SODIMM_2DPC_LIB.H55_DG2_2DPC(SCH_1):PAGE53; CDS_LIB: discrete; PCB Footprint: SMR0201IA; CDS_PART_NAME: RES_0201-C80792-009,EMPTY,0,5%,1/20W,LPDB,GENERIC; CDS_LOCATION: R5310; ASI_MODEL: C80792-009
R5311 = RES#1: PART_NUMBER: C80792-009; CHIPS_PART_NAME: RES; CDS_PHYS_PART_NAME: RES_0201-C80792-009,EMPTY,0,5%,1/20W,LPDB,GENERIC; WATTAGE: 1/20W; OriginalSymbolOrigin: (-75,25); XY: (4975,2575); VER: 1; PHYS_PAGE: 53; LOCATION: R5311; IP: GENERIC; FP_TECH: LPDB; FIN: USB_BPR; DRAWING: @RVP1_ADL_SB_ADP_S_DDR5_SODIMM_2DPC_LIB.H55_DG2_2DPC(SCH_1):PAGE53; CDS_LIB: discrete; PCB Footprint: SMR0201IA; ROT: 0; CDS_PART_NAME: RES_0201-C80792-009,EMPTY,0,5%,1/20W,LPDB,GENERIC; CDS_LOCATION: R5311; ASI_MODEL: C80792-009
R5312 = RES#1: PART_NUMBER: C80792-009; CHIPS_PART_NAME: RES; CDS_PHYS_PART_NAME: RES_0201-C80792-009,EMPTY,0,5%,1/20W,LPDB,GENERIC; WATTAGE: 1/20W; OriginalSymbolOrigin: (-75,25); XY: (4975,2175); VER: 1; PHYS_PAGE: 53; LOCATION: R5312; IP: GENERIC; FP_TECH: LPDB; FIN: USB_BPR; DRAWING: @RVP1_ADL_SB_ADP_S_DDR5_SODIMM_2DPC_LIB.H55_DG2_2DPC(SCH_1):PAGE53; CDS_LIB: discrete; PCB Footprint: SMR0201IA; ROT: 2; CDS_PART_NAME: RES_0201-C80792-009,EMPTY,0,5%,1/20W,LPDB,GENERIC; CDS_LOCATION: R5312; ASI_MODEL: C80792-009
R5313 = RES#1: PART_NUMBER: C80792-009; CHIPS_PART_NAME: RES; CDS_PHYS_PART_NAME: RES_0201-C80792-009,EMPTY,0,5%,1/20W,LPDB,GENERIC; WATTAGE: 1/20W; OriginalSymbolOrigin: (-75,25); XY: (4975,1575); PHYS_PAGE: 53; LOCATION: R5313; IP: GENERIC; FP_TECH: LPDB; FIN: USB_BPR; DRAWING: @RVP1_ADL_SB_ADP_S_DDR5_SODIMM_2DPC_LIB.H55_DG2_2DPC(SCH_1):PAGE53; CDS_LIB: discrete; PCB Footprint: SMR0201IA; VER: 1; ROT: 0; CDS_PART_NAME: RES_0201-C80792-009,EMPTY,0,5%,1/20W,LPDB,GENERIC; CDS_LOCATION: R5313; ASI_MODEL: C80792-009
R5316 = RES#1: PART_NUMBER: A93549-001; CHIPS_PART_NAME: RES; CDS_PHYS_PART_NAME: RES_0402-A93549-001,CHIP,0,5%,1/16W,LPDB,GENERIC; WATTAGE: 1/16W; OriginalSymbolOrigin: (-75,25); XY: (5275,225); VER: 1; PHYS_PAGE: 53; LOCATION: R5316; IP: GENERIC; FP_TECH: LPDB; DRAWING: @RVP1_ADL_SB_ADP_S_DDR5_SODIMM_2DPC_LIB.H55_DG2_2DPC(SCH_1):PAGE53; CDS_LIB: discrete; PCB Footprint: SMR0402IA; SEC_TYPE: 0402; ROT: 0; CDS_PART_NAME: RES_0402-A93549-001,CHIP,0,5%,1/16W,LPDB,GENERIC; CDS_LOCATION: R5316; ASI_MODEL: A93549-001
R5317 = RES: CDS_PHYS_PART_NAME: RES_0402-A93548-128,CHIP,100K,1%,1/16W,LPDB,GENERIC; OriginalSymbolOrigin: (-25,75); XY: (5500,-350); VER: 2; ROT: 0; PHYS_PAGE: 53; LOCATION: R5317; IP: GENERIC; FP_TECH: LPDB; DRAWING: @RVP1_ADL_SB_ADP_S_DDR5_SODIMM_2DPC_LIB.H55_DG2_2DPC(SCH_1):PAGE53; CDS_LIB: discrete; PCB Footprint: SMR0402IA; SEC_TYPE: 0402; CHIPS_PART_NAME: RES; CDS_PART_NAME: RES_0402-A93548-128,CHIP,100K,1%,1/16W,LPDB,GENERIC; CDS_LOCATION: R5317
R5318 = C_RES: CDS_PHYS_PART_NAME: C_RES_0402-G21796-021,EMPTY,1M,1%,0.0625W,TK2,GENERIC; CDS_LMAN_SYM_OUTLINE: -50,50,50,-50; FP_TECH: TK2; IP: GENERIC; ROOM: NONE; OriginalSymbolOrigin: (-25,75); XY: (4225,575); VER: 2; ROT: 0; PHYS_PAGE: 53; LOCATION: R5318; DRAWING: @RVP1_ADL_SB_ADP_S_DDR5_SODIMM_2DPC_LIB.H55_DG2_2DPC(SCH_1):PAGE53; CDS_LIB: c_discrete; VARIANT: ?; PCB Footprint: CTK2_SM0402_1100X550_MA; CHIPS_PART_NAME: C_RES; CDS_PART_NAME: C_RES_0402-G21796-021,EMPTY,1M,1%,0.0625W,TK2,GENERIC; CDS_LOCATION: R5318
R5319 = C_RES#1: CHIPS_PART_NAME: C_RES; CDS_PHYS_PART_NAME: C_RES_0402-G21796-021,EMPTY,1M,1%,0.0625W,TK2,GENERIC; CDS_LMAN_SYM_OUTLINE: -50,50,50,-50; FP_TECH: TK2; IP: GENERIC; ROOM: NONE; OriginalSymbolOrigin: (-75,25); XY: (5875,-150); VER: 1; ROT: 0; PHYS_PAGE: 53; LOCATION: R5319; DRAWING: @RVP1_ADL_SB_ADP_S_DDR5_SODIMM_2DPC_LIB.H55_DG2_2DPC(SCH_1):PAGE53; CDS_LIB: c_discrete; VARIANT: ?; PCB Footprint: CTK2_SM0402_1100X550_MA; CDS_PART_NAME: C_RES_0402-G21796-021,EMPTY,1M,1%,0.0625W,TK2,GENERIC; CDS_LOCATION: R5319
R5320 = RES#1: PART_NUMBER: A93549-001; CHIPS_PART_NAME: RES; CDS_PHYS_PART_NAME: RES_0402-A93549-001,CHIP,0,5%,1/16W,LPDB,GENERIC; WATTAGE: 1/16W; OriginalSymbolOrigin: (-75,25); XY: (4650,-175); VER: 1; PHYS_PAGE: 53; LOCATION: R5320; IP: GENERIC; FP_TECH: LPDB; DRAWING: @RVP1_ADL_SB_ADP_S_DDR5_SODIMM_2DPC_LIB.H55_DG2_2DPC(SCH_1):PAGE53; CDS_LIB: discrete; PCB Footprint: SMR0402IA; ROT: 0; CDS_PART_NAME: RES_0402-A93549-001,CHIP,0,5%,1/16W,LPDB,GENERIC; CDS_LOCATION: R5320; ASI_MODEL: A93549-001